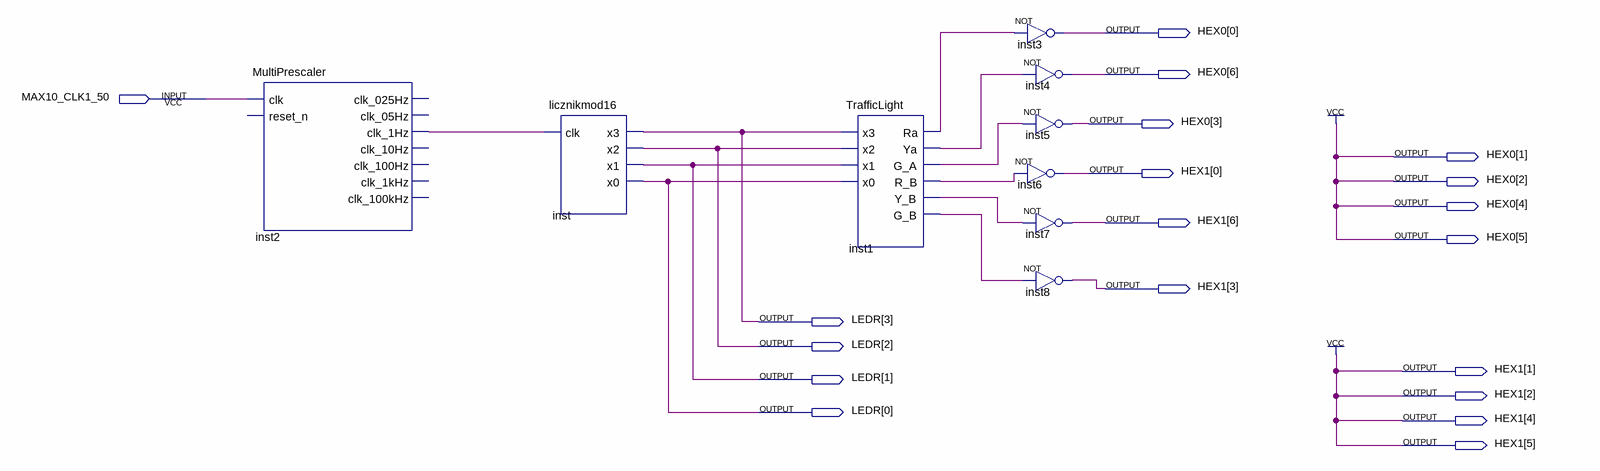
[diagram p0: schematic sheet]
// Quartus schematic swiatla.bdf as structural Verilog: 9 symbols, 19 pins
module swiatla (
  input  MAX10_CLK1_50,
  output [6:0] HEX0,
  output [6:0] HEX1,
  output [3:0] LEDR
);

  wire inst1_g_a, inst1_g_b, inst1_r_b, inst1_ra, inst1_y_b, inst1_ya, inst2_clk_1hz;

  MultiPrescaler inst2 (
    .clk(MAX10_CLK1_50), .clk_1Hz(inst2_clk_1hz));  // open: reset_n, clk_025Hz, clk_05Hz, clk_10Hz, clk_100Hz, clk_1kHz, clk_100kHz
  licznikmod16 inst (.clk(inst2_clk_1hz), .x3(LEDR[3]), .x2(LEDR[2]), .x1(LEDR[1]), .x0(LEDR[0]));
  TrafficLight inst1 (
    .x3(LEDR[3]), .x2(LEDR[2]), .x1(LEDR[1]), .x0(LEDR[0]), .Ra(inst1_ra), .Ya(inst1_ya), .G_A(inst1_g_a),
    .R_B(inst1_r_b), .Y_B(inst1_y_b), .G_B(inst1_g_b));
  not inst3 (HEX0[0], inst1_ra);
  not inst4 (HEX0[6], inst1_ya);
  not inst5 (HEX0[3], inst1_g_a);
  not inst6 (HEX1[0], inst1_r_b);
  not inst7 (HEX1[6], inst1_y_b);
  not inst8 (HEX1[3], inst1_g_b);

  assign {HEX0[5:4], HEX0[2:1]} = 4'b1111;
  assign {HEX1[5:4], HEX1[2:1]} = 4'b1111;
endmodule
